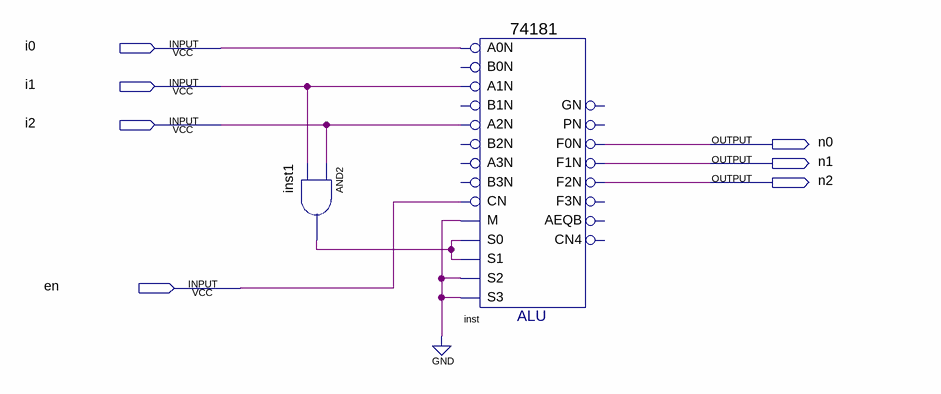
[diagram p0: schematic sheet]
// Quartus schematic fsm_logic_3bits.bdf as structural Verilog: 2 symbols, 7 pins
module fsm_logic_3bits (
  input  i0,
  input  i1,
  input  i2,
  input  en,
  output n0,
  output n1,
  output n2
);

  wire inst1_out;

  and inst1 (inst1_out, i2, i1);
  \74181  inst (
    .A0N(i0), .A1N(i1), .A2N(i2), .M(1'b0), .CN(en), .S2(1'b0), .S1(inst1_out), .S0(inst1_out), .S3(1'b0),
    .F1N(n1), .F0N(n0), .F2N(n2));  // open: B0N, B1N, A3N, B2N, B3N, PN, GN, F3N, AEQB, CN4
endmodule
